# Altium schematic sheet TopSheet.SchDoc
size A4; Website: www.ultrazohm.com; CompanyName: Technische Hochschule Nürnberg Georg Simon Ohm; Address1: Fürther Straße 250; Address2: 90429 Nürnberg; Address3: GERMANY; SheetNumber: 1; SheetTotal: 3; CompanyName2: Institut ELSYS
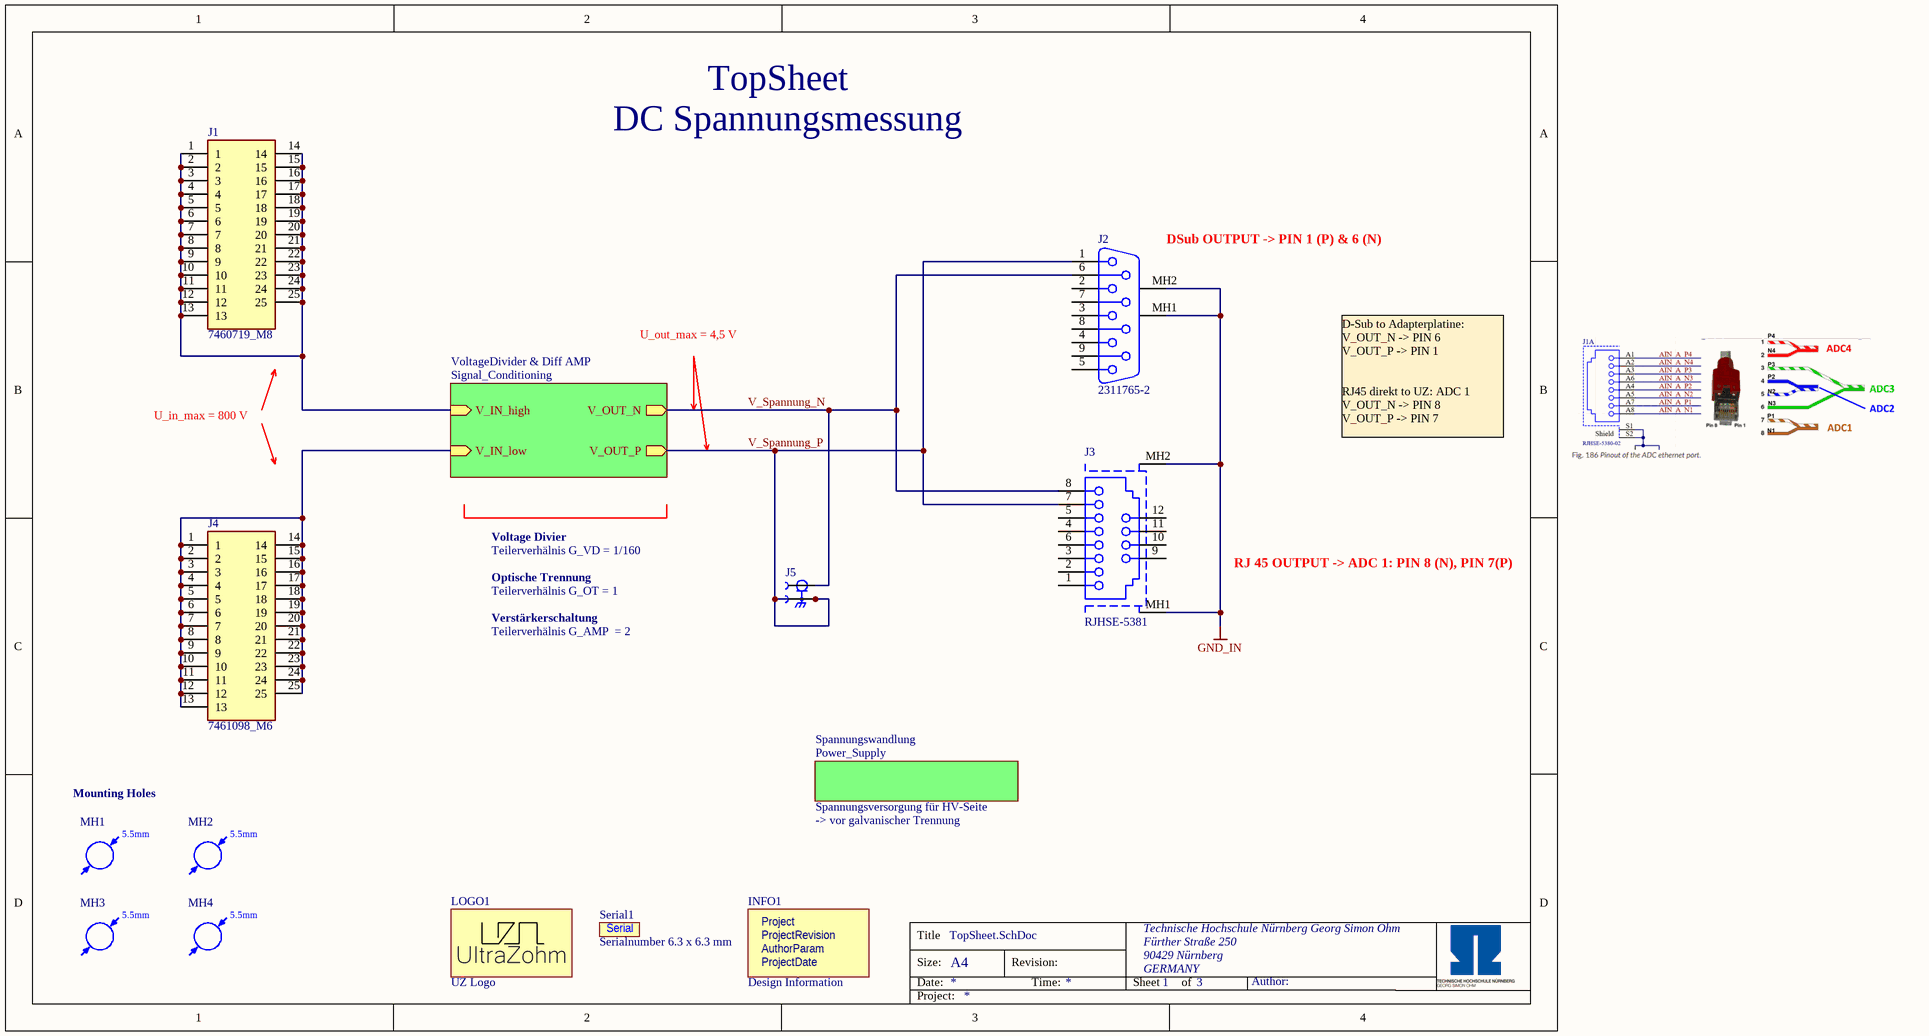
[diagram p0: TopSheet.SchDoc]

## Parts
INFO1  Design Information  [Design_info]  (no BOM)
J1  7460719_M8  [7460719]
J2  2311765-2  [23117652]
J3  RJHSE-5381  [RJHSE-5381]
J4  7461098_M6  [7461098]
J5  BNC5-J-P-GN-ST-TH2D_new  [BNC5-J-P-GN-ST-TH2D_new]  (value not drawn)
LOGO1  UZ Logo  [UZ_Logo_small]  (no BOM)
MH1  Mounting_Hole_M5  [Mounting Hole (M5)]  (value not drawn)
MH2  Mounting_Hole_M5  [Mounting Hole (M5)]  (value not drawn)
MH3  Mounting_Hole_M5  [Mounting Hole (M5)]  (value not drawn)
MH4  Mounting_Hole_M5  [Mounting Hole (M5)]  (value not drawn)
Serial1  Serialnumber 6.3 x 6.3 mm  [SERIAL_6.3X6.3MM]  (no BOM)

## Sub-sheets
Spannungswandlung = Power_Supply: no entries
VoltageDivider & Diff AMP = Signal_Conditioning: V_IN_high (in), V_IN_low (in), V_OUT_N (out), V_OUT_P (out)

## Nets
GND_IN: J2.MH1 J2.MH2 J3.MH1(Shell) J3.MH2(Shell)
V_Spannung_N: J2.6 J3.8 J5.1 ; sheet VoltageDivider & Diff AMP/V_OUT_N
V_Spannung_P: J2.1 J3.7 J5.S_1 J5.S_2 J5.S_3 ; sheet VoltageDivider & Diff AMP/V_OUT_P
NetJ1_1: J1.1 J1.2 J1.3 J1.4 J1.5 J1.6 J1.7 J1.8 J1.9 J1.10 J1.11 J1.12 J1.13 J1.14 J1.15 J1.16 J1.17 J1.18 J1.19 J1.20 J1.21 J1.22 J1.23 J1.24 J1.25 ; sheet VoltageDivider & Diff AMP/V_IN_high
NetJ4_1: J4.1 J4.2 J4.3 J4.4 J4.5 J4.6 J4.7 J4.8 J4.9 J4.10 J4.11 J4.12 J4.13 J4.14 J4.15 J4.16 J4.17 J4.18 J4.19 J4.20 J4.21 J4.22 J4.23 J4.24 J4.25 ; sheet VoltageDivider & Diff AMP/V_IN_low

Not connected (* = marked no-connect by the designer): J2 2 3 4 5 7 8 9; J3 1 2 3 4 5 6 9(8) 10(8) 11(8) 12(8)

## Notes on the sheet
- TopSheet
- DC Spannungsmessung
- (near J2) DSub OUTPUT -> PIN 1 (P) & 6 (N)
- Type @ to refer to a designator or a net
- U_out_max = 4,5 V
- U_in_max = 800 V
- D-Sub to Adapterplatine:
  V_OUT_N -> PIN 6
  V_OUT_P -> PIN 1
  RJ45 direkt to UZ: ADC 1
  V_OUT_N -> PIN 8
  V_OUT_P -> PIN 7
- Voltage Divier
- Teilerverhälnis G_VD = 1/160
- Optische Trennung
- RJ 45 OUTPUT -> ADC 1: PIN 8 (N), PIN 7(P)
- Teilerverhälnis G_OT = 1
- Verstärkerschaltung
- Teilerverhälnis G_AMP  = 2
- Mounting Holes
- Spannungsversorgung für HV-Seite
- -> vor galvanischer Trennung
- Title
- Size:
- Date:
- A4
- Revision:
- Time:
- Sheet
- of
- Author:
- Project:
- (in symbol Design Information) Project; ProjectRevision; AuthorParam; ProjectDate
- (in symbol Mounting_Hole_M5) 5.5mm
- (in symbol Serial Number) Serial

## Library data of the parts
INFO1 = Design Information: Design InformationS; Manufacturer: UltraZohm; Created from: MGremer; Manufacturer Part Number: Design Information; PartID: 12; Created On: 03.11.2021 09:04:23; ComponentLink1Description: https://docs.ultrazohm.com/; ComponentLink1URL: homepage; Component Type: Design Information; Last Updated: 03.11.2021 09:28:34; Supplier 1: -; Supplier Part Number 1: -; Type: Design Information; Value: Design Information; Live Cycle Status: 1
J1 = 7460719_M8: Connector; Manufacturer_Name: Wurth Elektronik; Datasheet Link: https://www.mouser.com/datasheet/2/445/7460719-1723637.pdf; Height: 20.5mm; Manufacturer_Part_Number: 7460719; Mouser Part Number: 710-7460719; Mouser Price/Stock: https://www.mouser.co.uk/ProductDetail/Wurth-Elektronik/7460719?qs=lykWx4dhCCHoCGzpKhOnqA%3D%3D; Supplier 1: Mouser; Supplier Part Number 1: 710-7460719
J2 = 2311765-2: Connector D-Sub 9 Pin Female; Manufacturer_Name: TE Connectivity; Datasheet Link: https://www.te.com/commerce/DocumentDelivery/DDEController?Action=showdoc&DocId=Customer+Drawing%7F2311765%7FD%7Fpdf%7FEnglish%7FENG_CD_2311765_D.pdf%7F2311765-2; Height: 12.8mm; Manufacturer_Part_Number: 2311765-2; Mouser Part Number: 571-2311765-2; Mouser Price/Stock: https://www.mouser.co.uk/ProductDetail/TE-Connectivity/2311765-2?qs=rrS6PyfT74frdzrH7SJRfg%3D%3D; Arrow Part Number: 2311765-2; Arrow Price/Stock: https://www.arrow.com/en/products/2311765-2/te-connectivity?region=nac; Supplier 1: Mouser; Supplier Part Number 1: 571-2311765-2
J3 = RJHSE-5381: Connector Ethernet R/A RJ45 SHIELDED 8 CONT Y/G LEDS; Supplier 1: Mouser; Supplier Part Number 1: 523-RJHSE-5381
J4 = 7461098_M6: Connector; Manufacturer_Name: Wurth Elektronik; Datasheet Link: https://katalog.we-online.com/em/datasheet/7461098.pdf; Height: 15.5mm; Manufacturer_Part_Number: 7461098; Mouser Part Number: 710-7461098; Mouser Price/Stock: https://www.mouser.co.uk/ProductDetail/Wurth-Elektronik/7461098?qs=lykWx4dhCCGHHs7z4oM%2FDg%3D%3D; Supplier 1: Mouser; Supplier Part Number 1: 710-7461098
J5 = BNC5-J-P-GN-ST-TH2D_new: BNC Connector; Supplier 1: Mouser; Supplier Part Number 1: 200-BNC5JPGNSTTH2D
LOGO1 = Logo small: Manufacturer: UltraZohm; Created from: MGremer; Created: Jan2021_Liegmann; Value: Logo; Manufacturer Part Number: Logo small; PartID: 10; Created On: 03.11.2021 09:04:23; ComponentLink1Description: https://docs.ultrazohm.com/; ComponentLink1URL: homepage; Component Type: Logo; Last Updated: 03.11.2021 09:05:50; Supplier 1: -; Supplier Part Number 1: -; Type: Logo; Live Cycle Status: 1
MH1-MH4 = Mounting_Hole_M5: Mounting Hole
Serial1 = Serial Number: Manufacturer: UltraZohm; Value: REV; Created from: MGremer; Created: 2018_09_18_AGeiger; Manufacturer Part Number: Serial Number; PartID: 11; Created On: 03.11.2021 09:04:23; ComponentLink1Description: https://docs.ultrazohm.com/; ComponentLink1URL: homepage; Component Type: Serial Number; Last Updated: 03.11.2021 09:28:34; Supplier 1: -; Supplier Part Number 1: -; Type: Serial Number; Live Cycle Status: 1